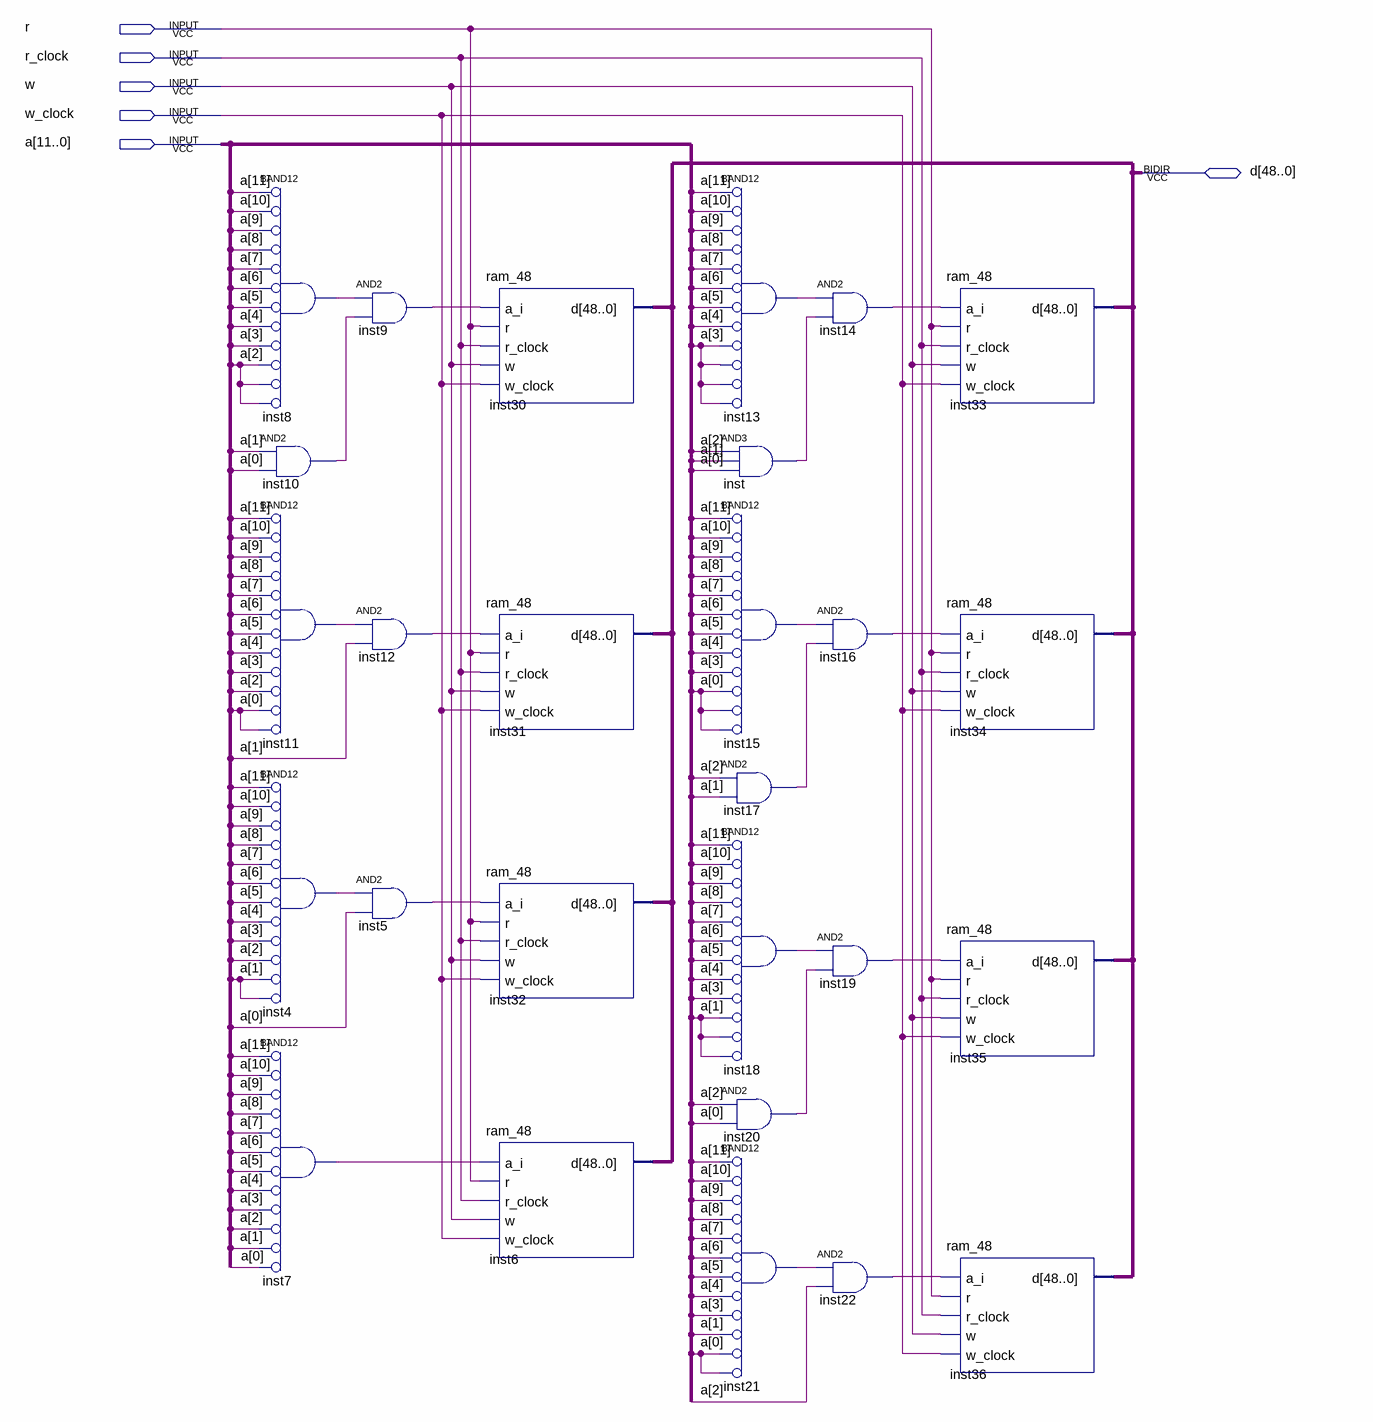
[diagram p0: schematic sheet]
// Quartus schematic ram.bdf as structural Verilog: 27 symbols, 6 pins
module ram (
  input  r,
  input  r_clock,
  input  w,
  input  w_clock,
  input  [11:0] a,
  inout  [48:0] d
);

  wire inst4_out, inst5_out, inst7_out, inst8_out, inst9_out, inst10_out, inst11_out, inst12_out, inst13_out,
       inst14_out, inst15_out, inst16_out, inst17_out, inst18_out, inst19_out, inst20_out, inst21_out,
       inst22_out, inst_out;

  and inst8 (inst8_out, ~a[11], ~a[10], ~a[9], ~a[8], ~a[7], ~a[6], ~a[5], ~a[4], ~a[3], ~a[2], ~a[2], ~a[2]);  // BAND12
  and inst10 (inst10_out, a[1], a[0]);
  and inst11 (inst11_out, ~a[11], ~a[10], ~a[9], ~a[8], ~a[7], ~a[6], ~a[5], ~a[4], ~a[3], ~a[2], ~a[0], ~a[0]);  // BAND12
  and inst4 (inst4_out, ~a[11], ~a[10], ~a[9], ~a[8], ~a[7], ~a[6], ~a[5], ~a[4], ~a[3], ~a[2], ~a[1], ~a[1]);  // BAND12
  and inst7 (inst7_out, ~a[11], ~a[10], ~a[9], ~a[8], ~a[7], ~a[6], ~a[5], ~a[4], ~a[3], ~a[2], ~a[1], ~a[0]);  // BAND12
  and inst9 (inst9_out, inst8_out, inst10_out);
  and inst12 (inst12_out, inst11_out, a[1]);
  and inst5 (inst5_out, inst4_out, a[0]);
  ram_48 inst30 (.a_i(inst9_out), .r(r), .r_clock(r_clock), .w(w), .w_clock(w_clock), .d(d));
  ram_48 inst31 (.a_i(inst12_out), .r(r), .r_clock(r_clock), .w(w), .w_clock(w_clock), .d(d));
  ram_48 inst32 (.a_i(inst5_out), .r(r), .r_clock(r_clock), .w(w), .w_clock(w_clock), .d(d));
  ram_48 inst6 (.a_i(inst7_out), .r(r), .r_clock(r_clock), .w(w), .w_clock(w_clock), .d(d));
  and inst13 (inst13_out, ~a[11], ~a[10], ~a[9], ~a[8], ~a[7], ~a[6], ~a[5], ~a[4], ~a[3], ~a[3], ~a[3], ~a[3]);  // BAND12
  and inst (inst_out, a[2], a[1], a[0]);
  and inst15 (inst15_out, ~a[11], ~a[10], ~a[9], ~a[8], ~a[7], ~a[6], ~a[5], ~a[4], ~a[3], ~a[0], ~a[0], ~a[0]);  // BAND12
  and inst17 (inst17_out, a[2], a[1]);
  and inst18 (inst18_out, ~a[11], ~a[10], ~a[9], ~a[8], ~a[7], ~a[6], ~a[5], ~a[4], ~a[3], ~a[1], ~a[1], ~a[1]);  // BAND12
  and inst20 (inst20_out, a[2], a[0]);
  and inst21 (inst21_out, ~a[11], ~a[10], ~a[9], ~a[8], ~a[7], ~a[6], ~a[5], ~a[4], ~a[3], ~a[1], ~a[0], ~a[0]);  // BAND12
  and inst14 (inst14_out, inst13_out, inst_out);
  and inst16 (inst16_out, inst15_out, inst17_out);
  and inst19 (inst19_out, inst18_out, inst20_out);
  and inst22 (inst22_out, inst21_out, a[2]);
  ram_48 inst33 (.a_i(inst14_out), .r(r), .r_clock(r_clock), .w(w), .w_clock(w_clock), .d(d));
  ram_48 inst34 (.a_i(inst16_out), .r(r), .r_clock(r_clock), .w(w), .w_clock(w_clock), .d(d));
  ram_48 inst35 (.a_i(inst19_out), .r(r), .r_clock(r_clock), .w(w), .w_clock(w_clock), .d(d));
  ram_48 inst36 (.a_i(inst22_out), .r(r), .r_clock(r_clock), .w(w), .w_clock(w_clock), .d(d));
endmodule
